# Altium schematic sheet pcmcia.SchDoc
size A3
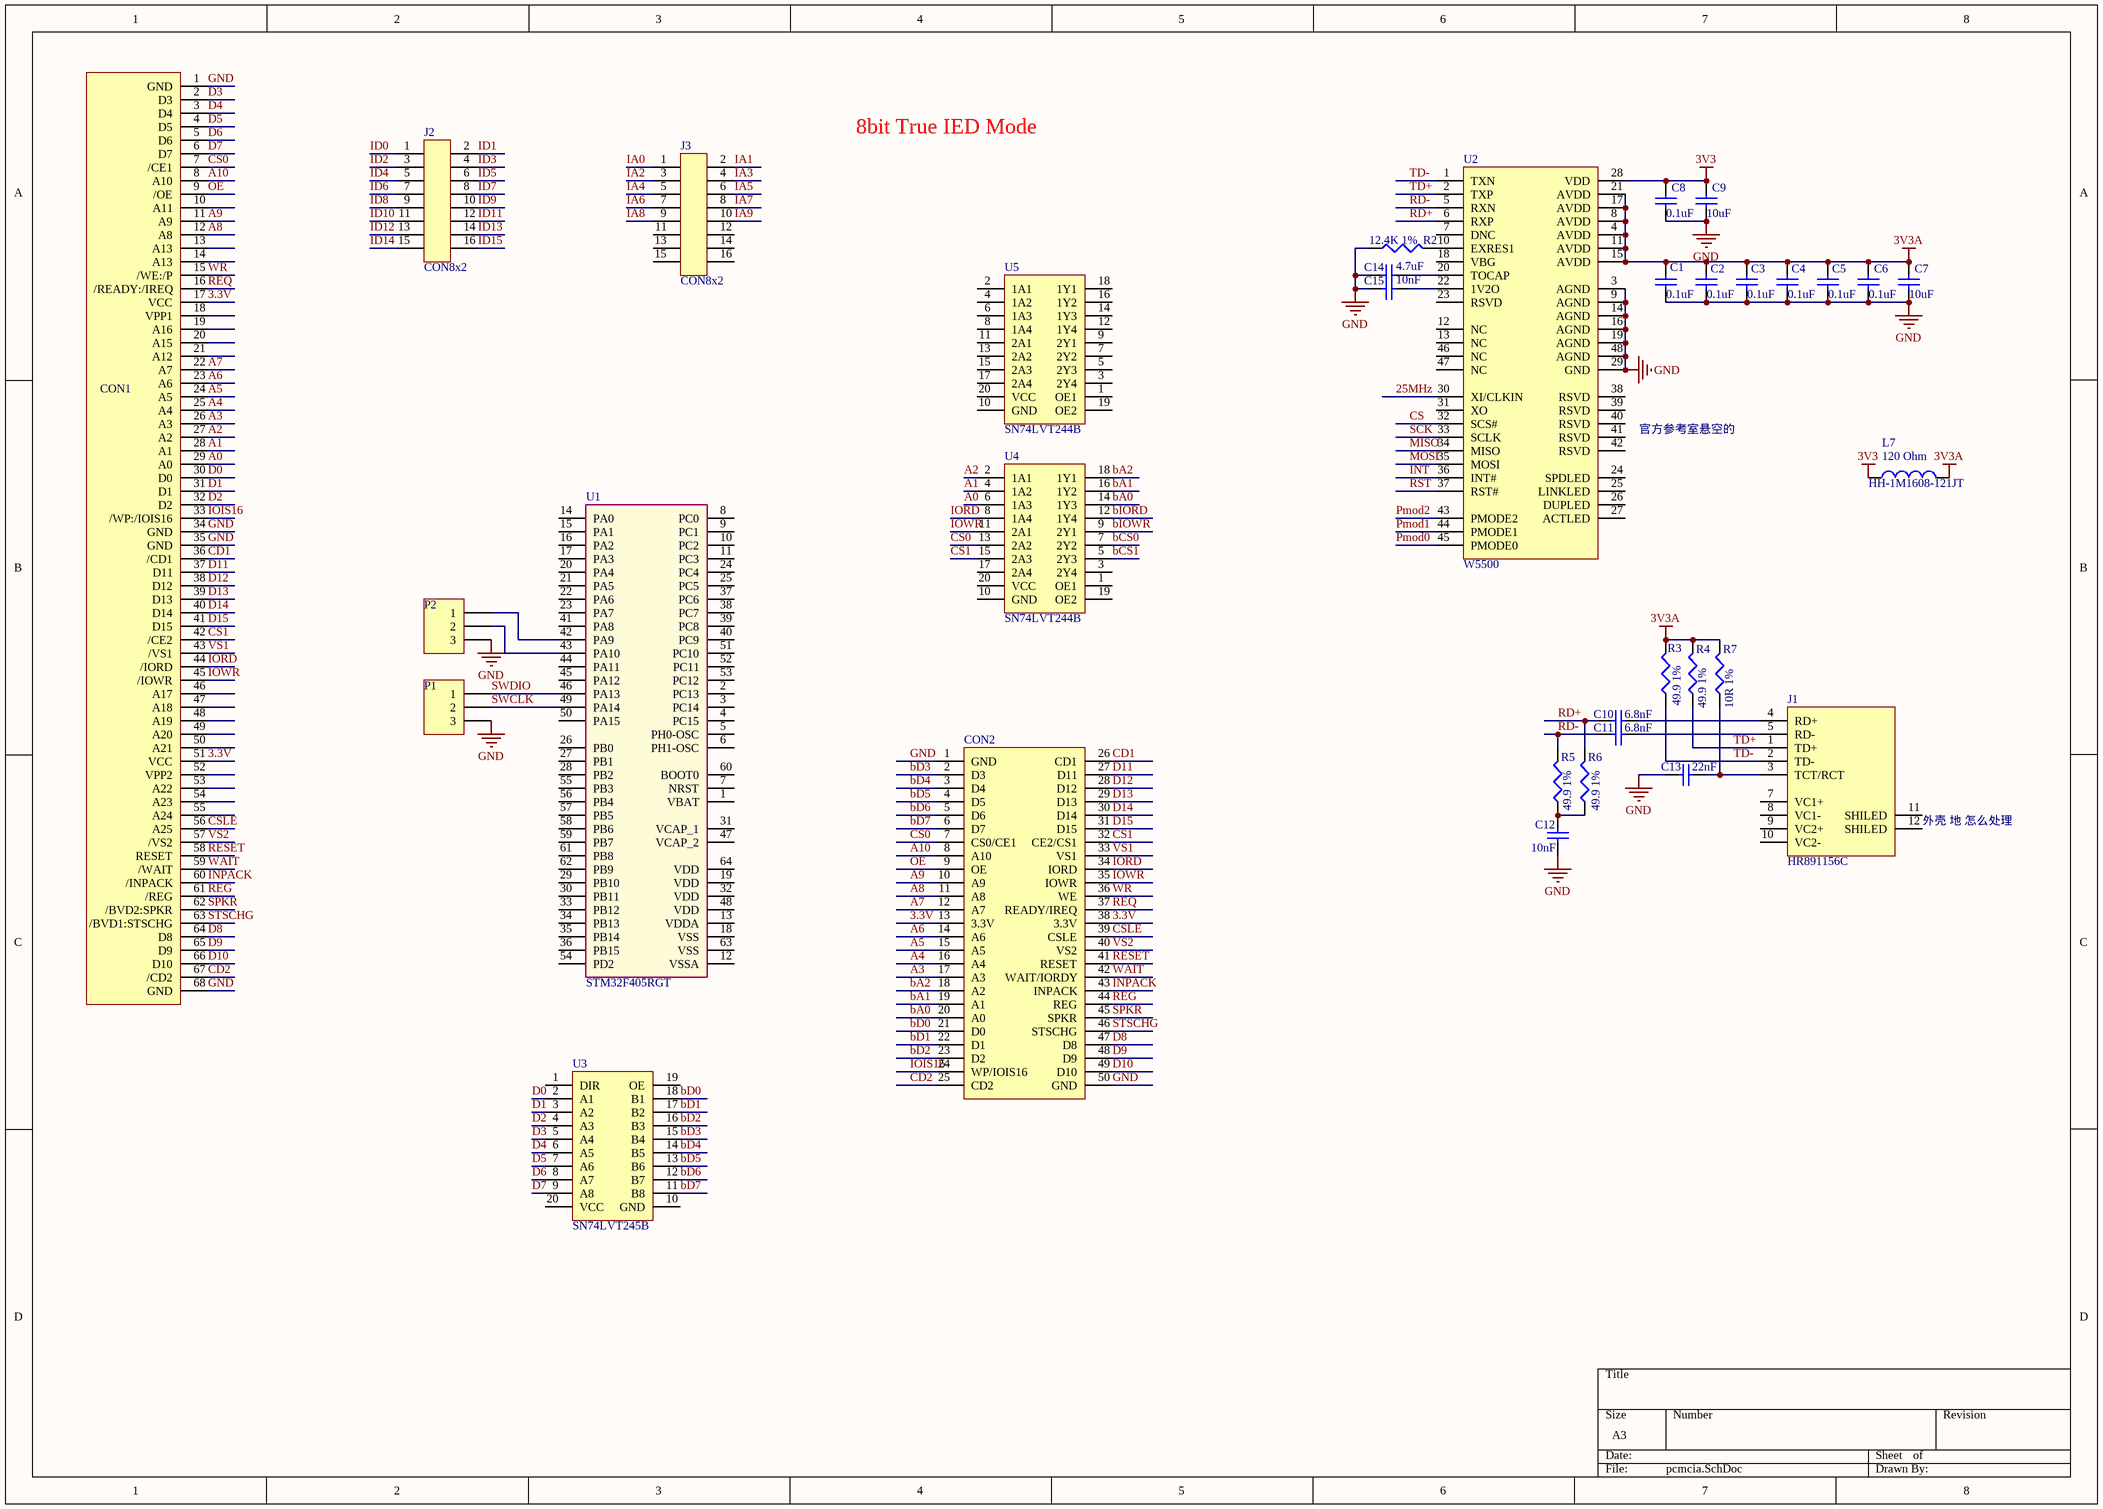
[diagram p0: pcmcia.SchDoc]

## Parts
C1  value 0.1uF  [0603_C]
C2  value 0.1uF  [0603_C]
C3  value 0.1uF  [0603_C]
C4  value 0.1uF  [0603_C]
C5  value 0.1uF  [0603_C]
C6  value 0.1uF  [0603_C]
C7  value 10uF  [0603_C]
C8  value 0.1uF  [C0603]
C9  value 10uF  [C0603]
C10  value 6.8nF  [0603_C]
C11  value 6.8nF  [0603_C]
C12  value 10nF  [0603_C]
C13  value 22nF  [0603_C]
C14  value 4.7uF  [0603_C]
C15  value 10nF  [0603_C]
CON1  Ultrasonic  [PCMCIA_68pin_F]  (value not drawn)
CON2  AT89S52_1  [DIP40]  (value not drawn)
J1  HR891156C  [HR891156C]
J2  CON8x2  [CON8x2]
J3  CON8x2  [CON8x2]
L7  HH-1M1608-121JT  [L0805]
P1  (no value)  [CON3-SMT]
P2  (no value)  [CON3-SMT]
R2  value 12.4K 1%  [0603_R]
R3  value 49.9 1%  [0603_R]
R4  value 49.9 1%  [0603_R]
R5  value 49.9 1%  [0603_R]
R6  value 49.9 1%  [0603_R]
R7  value 10R 1%  [0603_R]
U1  STM32F405RGT  [LQFP64-10x10]
U2  W5500  [LQFP48-7x7]
U3  SN74LVT245B
U4  SN74LVT244B
U5  SN74LVT244B

## Nets
3V3: C8.2 C9.2 L7.1 U2.28(VDD)
3V3A: C1.2 C2.2 C3.2 C4.2 C5.2 C6.2 C7.2 L7.2 R3.2 R4.2 R7.2 U2.4(AVDD) U2.8(AVDD) U2.11(AVDD) U2.15(AVDD) U2.17(AVDD) U2.21(AVDD)
GND: C1.1 C2.1 C3.1 C4.1 C5.1 C6.1 C7.1 C8.1 C9.1 C12.2 C13.1 C14.2 C15.2 CON1.1(GND) CON1.34(GND) CON1.35(GND) CON1.68(GND) CON2.1(GND) CON2.50(GND) P1.3 P2.3 R2.1 U2.3(AGND) U2.9(AGND) U2.14(AGND) U2.16(AGND) U2.19(AGND) U2.29(GND) U2.48(AGND)
3.3V: CON1.17(VCC) CON1.51(VCC) CON2.13(3.3V) CON2.38(3.3V)
25MHz: U2.30(XI/CLKIN)
A0: CON1.29(A0) U4.6(1A3)
A1: CON1.28(A1) U4.4(1A2)
A2: CON1.27(A2) U4.2(1A1)
A3: CON1.26(A3) CON2.17(A3)
A4: CON1.25(A4) CON2.16(A4)
A5: CON1.24(A5) CON2.15(A5)
A6: CON1.23(A6) CON2.14(A6)
A7: CON1.22(A7) CON2.12(A7)
A8: CON1.12(A8) CON2.11(A8)
A9: CON1.11(A9) CON2.10(A9)
A10: CON1.8(A10) CON2.8(A10)
bA0: CON2.20(A0) U4.14(1Y3)
bA1: CON2.19(A1) U4.16(1Y2)
bA2: CON2.18(A2) U4.18(1Y1)
bCS0: U4.7(2Y2)
bCS1: U4.5(2Y3)
bD0: CON2.21(D0) U3.18(B1)
bD1: CON2.22(D1) U3.17(B2)
bD2: CON2.23(D2) U3.16(B3)
bD3: CON2.2(D3) U3.15(B4)
bD4: CON2.3(D4) U3.14(B5)
bD5: CON2.4(D5) U3.13(B6)
bD6: CON2.5(D6) U3.12(B7)
bD7: CON2.6(D7) U3.11(B8)
bIORD: U4.12(1Y4)
bIOWR: U4.9(2Y1)
CD1: CON1.36(/CD1) CON2.26(CD1)
CD2: CON1.67(/CD2) CON2.25(CD2)
CS: U2.32(SCS#)
CS0: CON1.7(/CE1) CON2.7(CS0/CE1) U4.13(2A2)
CS1: CON1.42(/CE2) CON2.32(CE2/CS1) U4.15(2A3)
CSLE: CON1.56(A25) CON2.39(CSLE)
D0: CON1.30(D0) U3.2(A1)
D1: CON1.31(D1) U3.3(A2)
D2: CON1.32(D2) U3.4(A3)
D3: CON1.2(D3) U3.5(A4)
D4: CON1.3(D4) U3.6(A5)
D5: CON1.4(D5) U3.7(A6)
D6: CON1.5(D6) U3.8(A7)
D7: CON1.6(D7) U3.9(A8)
D8: CON1.64(D8) CON2.47(D8)
D9: CON1.65(D9) CON2.48(D9)
D10: CON1.66(D10) CON2.49(D10)
D11: CON1.37(D11) CON2.27(D11)
D12: CON1.38(D12) CON2.28(D12)
D13: CON1.39(D13) CON2.29(D13)
D14: CON1.40(D14) CON2.30(D14)
D15: CON1.41(D15) CON2.31(D15)
IA0: J3.1
IA1: J3.2
IA2: J3.3
IA3: J3.4
IA4: J3.5
IA5: J3.6
IA6: J3.7
IA7: J3.8
IA8: J3.9
IA9: J3.10
ID0: J2.1
ID1: J2.2
ID2: J2.3
ID3: J2.4
ID4: J2.5
ID5: J2.6
ID6: J2.7
ID7: J2.8
ID8: J2.9
ID9: J2.10
ID10: J2.11
ID11: J2.12
ID12: J2.13
ID13: J2.14
ID14: J2.15
ID15: J2.16
INPACK: CON1.60(/INPACK) CON2.43(INPACK)
INT: U2.36(INT#)
IOIS16: CON1.33(/WP:/IOIS16) CON2.24(WP/IOIS16)
IORD: CON1.44(/IORD) CON2.34(IORD) U4.8(1A4)
IOWR: CON1.45(/IOWR) CON2.35(IOWR) U4.11(2A1)
MISO: U2.34(MISO)
MOSI: U2.35(MOSI)
OE: CON1.9(/OE) CON2.9(OE)
Pmod0: U2.45(PMODE0)
Pmod1: U2.44(PMODE1)
Pmod2: U2.43(PMODE2)
RD+: C10.2 R6.2 U2.6(RXP)
RD-: C11.2 R5.2 U2.5(RXN)
REG: CON1.61(/REG) CON2.44(REG)
REQ: CON1.16(/READY:/IREQ) CON2.37(READY/IREQ)
RESET: CON1.58(RESET) CON2.41(RESET)
RST: U2.37(RST#)
SCK: U2.33(SCLK)
SPKR: CON1.62(/BVD2:SPKR) CON2.45(SPKR)
STSCHG: CON1.63(/BVD1:STSCHG) CON2.46(STSCHG)
SWCLK: P1.2 U1.49(PA14)
SWDIO: P1.1 U1.46(PA13)
TD+: J1.1(TD+) R4.1 U2.2(TXP)
TD-: J1.2(TD-) R3.1 U2.1(TXN)
VS1: CON1.43(/VS1) CON2.33(VS1)
VS2: CON1.57(/VS2) CON2.40(VS2)
WAIT: CON1.59(/WAIT) CON2.42(WAIT/IORDY)
WR: CON1.15(/WE:/P) CON2.36(WE)
NetC10_1: C10.1 J1.4(RD+)
NetC11_1: C11.1 J1.5(RD-)
NetC12_1: C12.1 R5.1 R6.1
NetC13_2: C13.2 J1.3(TCT/RCT) R7.1
NetC14_1: C14.1 U2.20(TOCAP)
NetC15_1: C15.1 U2.22(1V2O)
NetP2_1: P2.1 U1.42(PA9)
NetP2_2: P2.2 U1.43(PA10)
NetR2_2: R2.2 U2.10(EXRES1)

Not connected (* = marked no-connect by the designer): CON1 10(A11) 13(A13) 14(A13) 18(VPP1) 19(A16) 20(A15) 21(A12) 46(A17) 47(A18) 48(A19) 49(A20) 50(A21) 52(VPP2) 53(A22) 54(A23) 55(A24); J1 7(VC1+) 8(VC1-) 9(VC2+) 10(VC2-) 11(SHILED) 12(SHILED); J3 11 12 13 14 15 16; U1 1(VBAT) 2(PC13) 3(PC14) 4(PC15) 5(PH0-OSC) 6(PH1-OSC) 7(NRST) 8(PC0) 9(PC1) 10(PC2) 11(PC3) 12(VSSA) 13(VDDA) 14(PA0) 15(PA1) 16(PA2) 17(PA3) 18(VSS) 19(VDD) 20(PA4) 21(PA5) 22(PA6) 23(PA7) 24(PC4) 25(PC5) 26(PB0) 27(PB1) 28(PB2) 29(PB10) 30(PB11) 31(VCAP_1) 32(VDD) 33(PB12) 34(PB13) 35(PB14) 36(PB15) 37(PC6) 38(PC7) 39(PC8) 40(PC9) 41(PA8) 44(PA11) 45(PA12) 47(VCAP_2) 48(VDD) 50(PA15) 51(PC10) 52(PC11) 53(PC12) 54(PD2) 55(PB3) 56(PB4) 57(PB5) 58(PB6) 59(PB7) 60(BOOT0) 61(PB8) 62(PB9) 63(VSS) 64(VDD); U2 7(DNC) 12(NC) 13(NC) 18(VBG) 23(RSVD) 24(SPDLED) 25(LINKLED) 26(DUPLED) 27(ACTLED) 31(XO) 38(RSVD) 39(RSVD) 40(RSVD) 41(RSVD) 42(RSVD) 46(NC) 47(NC); U3 1(DIR) 10(GND) 19(OE) 20(VCC); U4 1(OE1) 3(2Y4) 10(GND) 17(2A4) 19(OE2) 20(VCC); U5 1(OE1) 2(1A1) 3(2Y4) 4(1A2) 5(2Y3) 6(1A3) 7(2Y2) 8(1A4) 9(2Y1) 10(GND) 11(2A1) 12(1Y4) 13(2A2) 14(1Y3) 15(2A3) 16(1Y2) 17(2A4) 18(1Y1) 19(OE2) 20(VCC)

## Notes on the sheet
- 8bit True IED Mode
- (near U2) 官方参考室悬空的
- (near J1) 外壳 地 怎么处理
- (in symbol Ind) 120 Ohm

## Library data of the parts
C1-C15 = Cap: Published: 8-Jun-2000; LatestRevisionDate: 29-May-2009; LatestRevisionNote: IPC-7351 Footprint Added.; PackageReference: C1206; Publisher: Altium Limited; PackageDescription: Chip Capacitor
J1 = HR891156C: with POE
L7 = Ind: Code_IEC: 1005; Published: 8-Jun-2000; LatestRevisionDate: 29-May-2009; LatestRevisionNote: IPC-7351 Footprint Added.; PackageReference: 0402-A; Publisher: Altium Limited; PackageDescription: Chip Inductor; Code_JEITA: 0402
P1 P2 = Header 3: Header, 3-Pin; LatestRevisionDate: 17-Jul-2002; LatestRevisionNote: Re-released for DXP Platform.; Publisher: Altium Limited
R2-R7 = Res: Published: 8-Jun-2000; LatestRevisionDate: 29-May-2009; LatestRevisionNote: IPC-7351 Footprint Added.; PackageReference: J1-0603; Publisher: Altium Limited; PackageDescription: Chip Resistor